# Altium schematic sheet MOSFETS.SchDoc
size A4; SheetNumber: 6; SheetTotal: 6
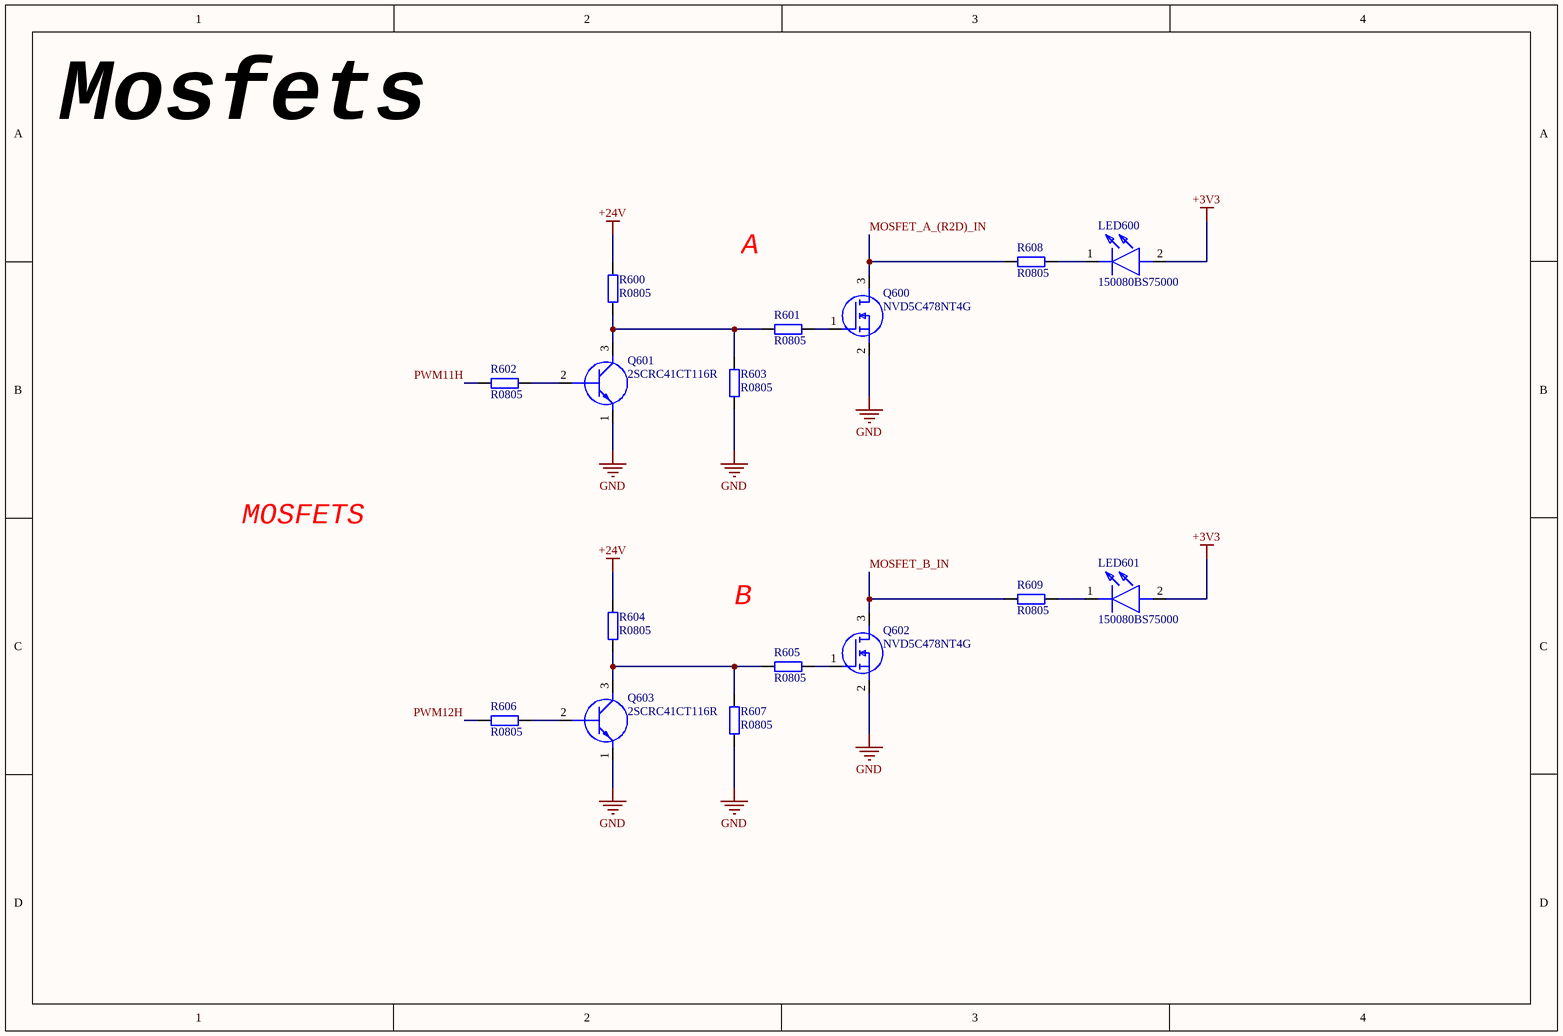
[diagram p0: MOSFETS.SchDoc]

## Parts
LED600  150080BS75000  [LEDC2012X80N]
LED601  150080BS75000  [LEDC2012X80N]
Q600  NVD5C478NT4G  [DPAK_(SINGLE-GAUGE)_TO-252(369C)_ISSUE_F]
Q601  2SCRC41CT116R  [SST2222AT116]
Q602  NVD5C478NT4G  [DPAK_(SINGLE-GAUGE)_TO-252(369C)_ISSUE_F]
Q603  2SCRC41CT116R  [SST2222AT116]
R600  R0805  [RES_0805]
R601  R0805  [RES_0805]
R602  R0805  [RES_0805]
R603  R0805  [RES_0805]
R604  R0805  [RES_0805]
R605  R0805  [RES_0805]
R606  R0805  [RES_0805]
R607  R0805  [RES_0805]
R608  R0805  [RES_0805]
R609  R0805  [RES_0805]

## Nets
+3V3: LED600.2(A) LED601.2(A)
+24V: R600.1 R604.1
GND: Q600.2(S) Q601.1(E) Q602.2(S) Q603.1(E) R603.2 R607.2
MOSFET_A_(R2D)_IN: Q600.3(D) R608.1
MOSFET_B_IN: Q602.3(D) R609.1
PWM11H: R602.1
PWM12H: R606.1
NetLED600_1: LED600.1(K) R608.2
NetLED601_1: LED601.1(K) R609.2
NetQ600_1: Q600.1(G) R601.2
NetQ601_2: Q601.2(B) R602.2
NetQ601_3: Q601.3(C) R600.2 R601.1 R603.1
NetQ602_1: Q602.1(G) R605.2
NetQ603_2: Q603.2(B) R606.2
NetQ603_3: Q603.3(C) R604.2 R605.1 R607.1

## Notes on the sheet
- Mosfets
- A
- MOSFETS
- B

## Library data of the parts
LED600 LED601 = 150080BS75000: LED; Manufacturer_Name: Wurth Elektronik; Datasheet Link: https://katalog.we-online.com/led/datasheet/150080BS75000.pdf; Height: 0.8mm; Manufacturer_Part_Number: 150080BS75000; Mouser Part Number: 710-150080BS75000; Mouser Price/Stock: https://www.mouser.co.uk/ProductDetail/Wurth-Elektronik/150080BS75000?qs=2kOmHSv6VfT2tBo3UPVqAQ%3D%3D
Q600 Q602 = NVD5C478NT4G: MOSFET (N-Channel); Manufacturer_Name: onsemi; Datasheet Link: http://www.onsemi.com/pub/Collateral/NVD5C478N-D.PDF; Manufacturer_Part_Number: NVD5C478NT4G; Mouser Part Number: 863-NVD5C478NT4G; Mouser Price/Stock: https://www.mouser.co.uk/ProductDetail/ON-Semiconductor/NVD5C478NT4G/?qs=y6ZabgHbY%252Bxvq0EyOcHTlg%3D%3D; Arrow Part Number: NVD5C478NT4G; Arrow Price/Stock: https://www.arrow.com/en/products/nvd5c478nt4g/on-semiconductor?region=nac
Q601 Q603 = 2SCRC41CT116R: Transistor BJT NPN; Manufacturer_Name: ROHM Semiconductor; Datasheet Link: https://datasheet.datasheetarchive.com/originals/distributors/Datasheets_SAMA/953df4fe31d6a1f75743e1da8a6d7a5d.pdf; Manufacturer_Part_Number: 2SCRC41CT116R; Mouser Part Number: 755-2SCRC41CT116; Mouser Price/Stock: https://www.mouser.co.uk/ProductDetail/ROHM-Semiconductor/2SCRC41CT116R?qs=BJlw7L4Cy7%252BOqTjwpUJKrw%3D%3D
R600-R609 = RES_0805: Resistor SMD 0805; Manufacturer: *; Manufacturer Part Number: *; Distributor Link: *; LCSC: *